# EAGLE design ESPLiveDC (EAGLE 7.7.0)
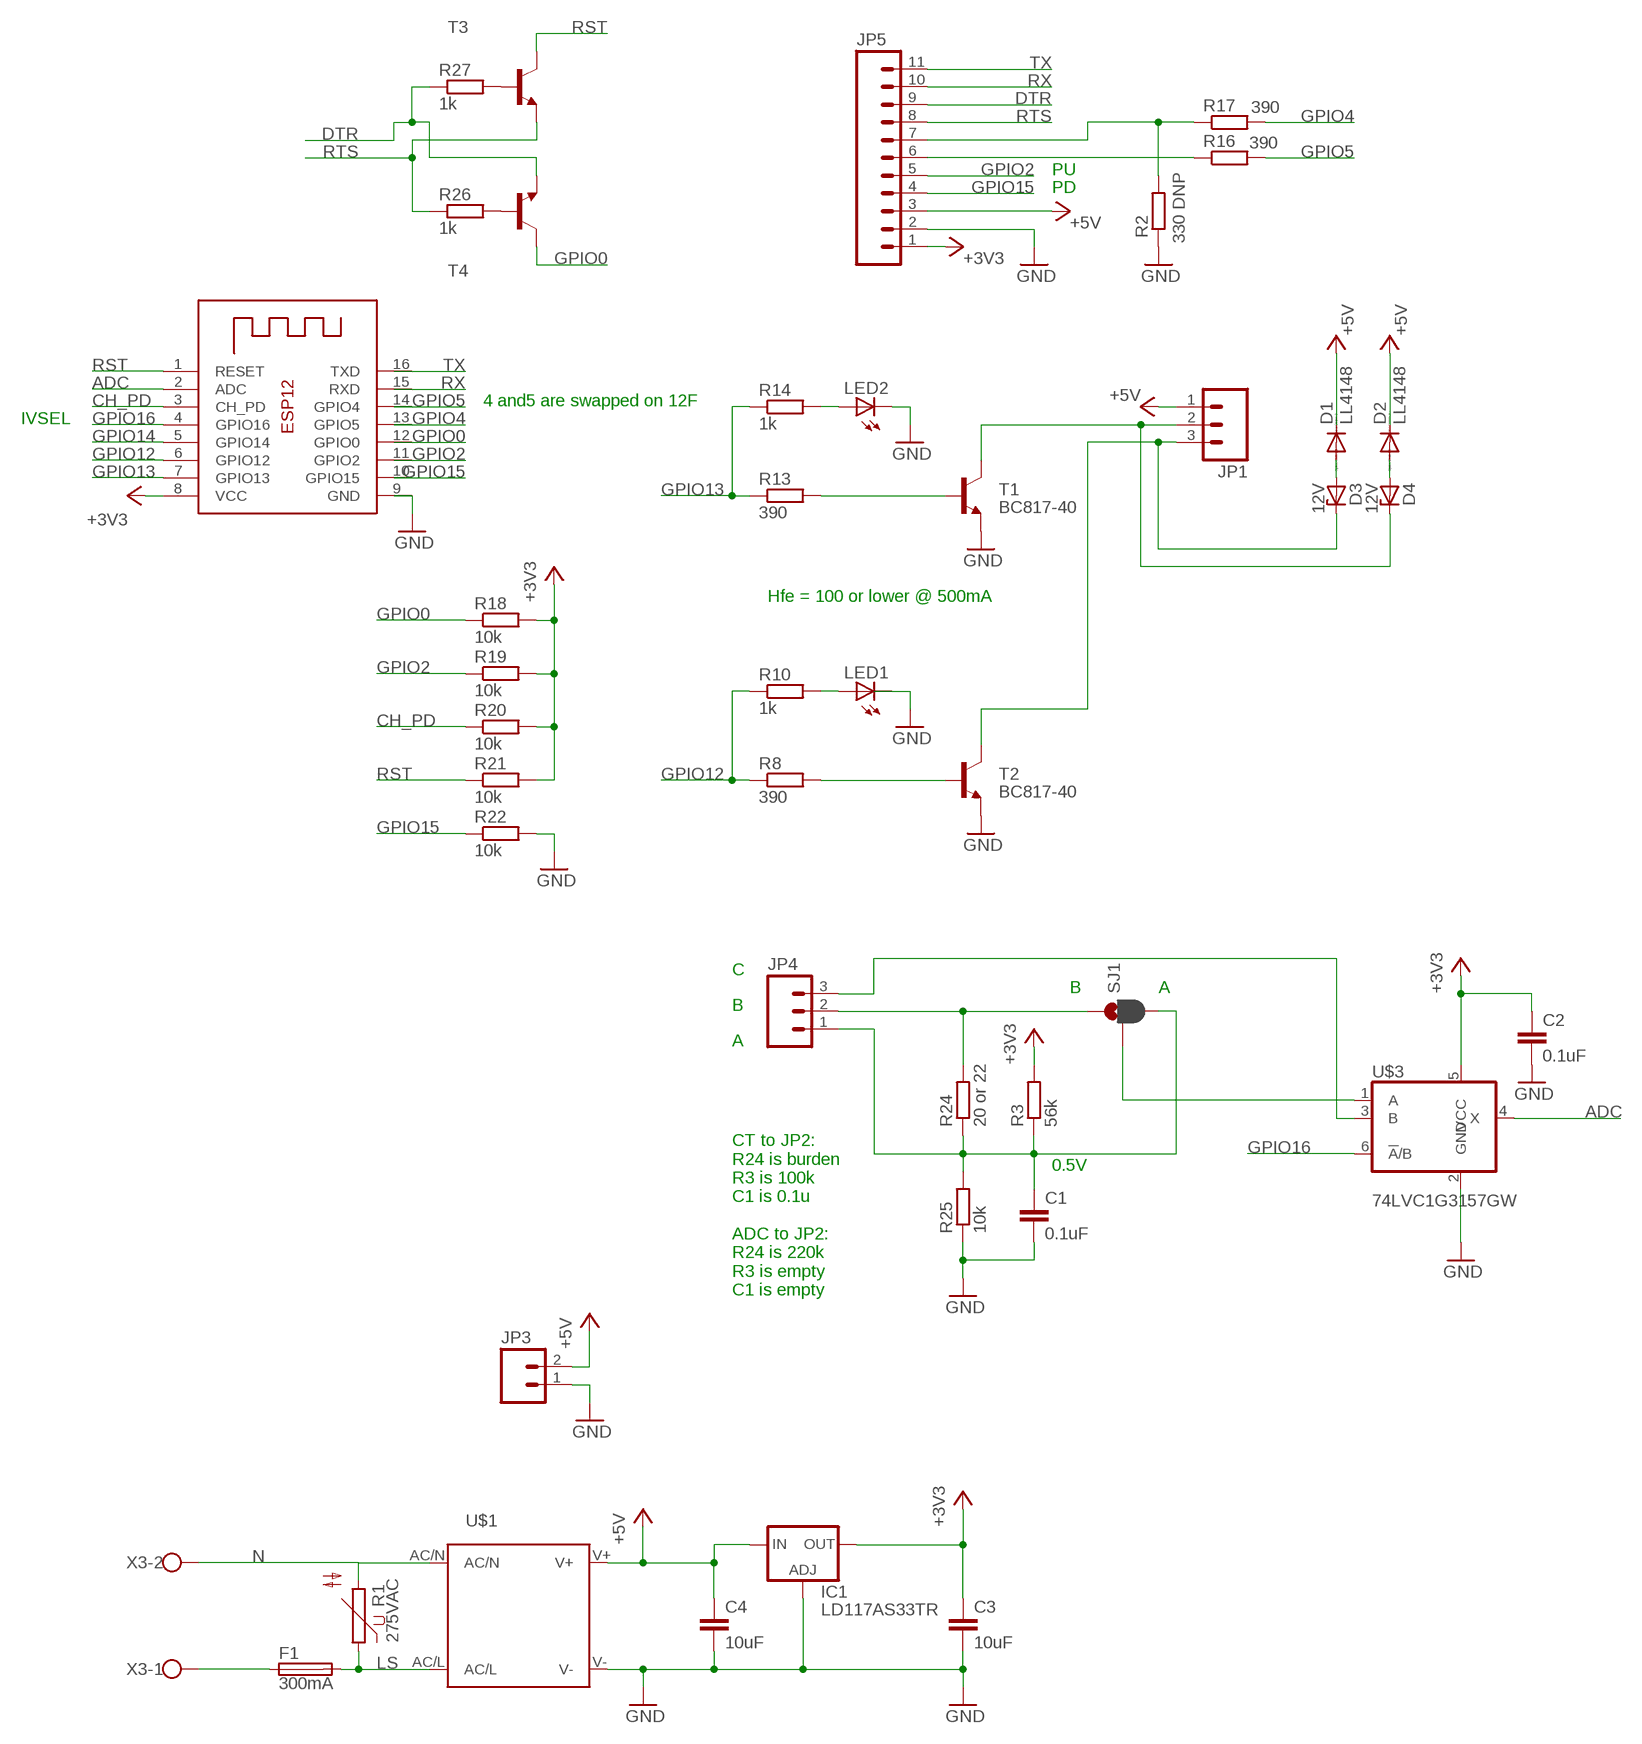
[diagram p0: schematic, sheet 1]

## Parts
C1  0.1uF  C-EUC0603  [C0603]
C2  0.1uF  C-EUC0603  [C0603]
C3  10uF  C-EUC0805  [C0805]
C4  10uF  C-EUC0805  [C0805]
D1  LL4148  DIODE-SOD80C  [SOD80C]
D2  LL4148  DIODE-SOD80C  [SOD80C]
D3  12V  ZENER-DIODESOD80C  [SOD80C]
D4  12V  ZENER-DIODESOD80C  [SOD80C]
F1  300mA  TE5  [TE5]
IC1  LD117AS33TR  [SOT223]
JP1  M03POLAR_LOCK  [MOLEX-1X3_LOCK]
JP3  M02POLAR_LOCK  [MOLEX-1X2_LOCK]
JP4  M03POLAR_LOCK  [MOLEX-1X3_LOCK]
JP5  M11LOCK  [1X11_LOCK]
LED1  LED1206  [LED-1206]
LED2  LED1206  [LED-1206]
R1  275VAC  P593  [P593]
R2  330 DNP  R-EU_R0603  [R0603]
R3  56k  R-EU_R0603  [R0603]
R8  390  R-EU_R0603  [R0603]
R10  1k  R-EU_R0603  [R0603]
R13  390  R-EU_R0603  [R0603]
R14  1k  R-EU_R0603  [R0603]
R16  390  R-EU_R0603  [R0603]
R17  390  R-EU_R0603  [R0603]
R18  10k  R-EU_R0603  [R0603]
R19  10k  R-EU_R0603  [R0603]
R20  10k  R-EU_R0603  [R0603]
R21  10k  R-EU_R0603  [R0603]
R22  10k  R-EU_R0603  [R0603]
R24  20 or 22  R-EU_R1206  [R1206]
R25  10k  R-EU_R0603  [R0603]
R26  1k  R-EU_R0603  [R0603]
R27  1k  R-EU_R0603  [R0603]
SJ1  JUMPER-PAD-3-2OF3_NC_BY_PASTE  [PAD-JUMPER-3-2OF3_NC_BY_PASTE_YES_SILK_FULL_BOX]
T1  BC817-40  BC817-40-NPN-SOT23-BEC  [SOT23-BEC]
T2  BC817-40  BC817-40-NPN-SOT23-BEC  [SOT23-BEC]
T3  BC817-40-NPN-SOT23-BEC  [SOT23-BEC]
T4  BC817-40-NPN-SOT23-BEC  [SOT23-BEC]
U$1  IRM_01/02_SMDIRM_01/02_SMD  [IRM_01/02_SMD]
U$3  74LVC1G3157GW  [SOT363]
X1  ESP-12  [ESP-12]
X3  W237-102  [W237-102]

## Nets
+3V3: C2.1 C3.1 IC1.4(OUT) JP5.1 R3.2 R18.2 R19.2 R20.2 R21.2 U$3.5(VCC) X1.8(VCC)
+5V: C4.1 D1.C D2.C IC1.3(IN) JP1.1 JP3.2 JP5.3 U$1.V+
ADC: U$3.4(X) X1.2(ADC)
CH_PD: R20.1 X1.3(CH_PD)
DTR: JP5.9 R27.1 T4.E
GND: C1.2 C2.2 C3.2 C4.2 IC1.1(ADJ) JP3.1 JP5.2 LED1.C LED2.C R2.1 R22.2 R25.1 T1.E T2.E U$1.V- U$3.2(GND) X1.9(GND)
GPIO0: R18.1 T4.C X1.12(GPIO0)
GPIO2: JP5.5 R19.1 X1.11(GPIO2)
GPIO4: R17.2 X1.13(GPIO5)
GPIO5: R16.2 X1.14(GPIO4)
GPIO12: R8.1 R10.1 X1.6(GPIO12)
GPIO13: R13.1 R14.1 X1.7(GPIO13)
GPIO14: X1.5(GPIO14)
GPIO15: JP5.4 R22.1 X1.10(GPIO15)
GPIO16: U$3.6(!A!/B) X1.4(GPIO16)
LS: F1.2 R1.1 U$1.AC/L
N: R1.2 U$1.AC/N X3.2
N$1: R13.2 T1.B
N$2: LED1.A R10.2
N$3: R8.2 T2.B
N$5: D4.C JP1.2 T1.C
N$6: D3.C JP1.3 T2.C
N$7: F1.1 X3.1
N$8: D1.A D3.A
N$9: D2.A D4.A
N$10: C1.1 JP4.1 R3.1 R24.1 R25.2 SJ1.3
N$11: JP4.2 R24.2 SJ1.1
N$12: SJ1.2 U$3.1(A)
N$13: JP4.3 U$3.3(B)
N$14: LED2.A R14.2
N$19: JP5.6 R16.1
N$20: JP5.7 R2.2 R17.1
N$22: R26.2 T4.B
N$23: R27.2 T3.B
RST: R21.1 T3.C X1.1(RESET)
RTS: JP5.8 R26.1 T3.E
RX: JP5.10 X1.15(RXD)
TX: JP5.11 X1.16(TXD)

## Notes on the sheet
- PU
- PD
- 4 and5 are swapped on 12F
- IVSEL
- Hfe = 100 or lower @ 500mA
- C
- B | A
- B
- A
- 0.5V
- CT to JP2:
  R24 is burden
  R3 is 100k
  C1 is 0.1u
  
  ADC to JP2:
  R24 is 220k
  R3 is empty
  C1 is empty

## Library data of the parts
C1-C4 = rcl:C-EU: CAPACITOR, European symbol
D1 D2 = diode:DIODE-: DIODE
D3 D4 = diode:ZENER-DIODE: Z-Diode
F1 = fuse:TE5: FUSE Wickmann; OC_FARNELL: unknown; OC_NEWARK: unknown
IC1 = v-reg:LD117A?*: Low drop fixed and adjustable positive voltage regulators 1 A Source: http://www.st.com/stonline/products/literature/ds/7194/ld1117axx.pdf
JP1 JP4 = SparkFun-Connectors:M03: Header 3 Standard 3-pin 0.1" header. Use with straight break away headers (SKU : PRT-00116), right angle break away headers (PRT-00553), swiss pins (PRT-00743), machine pins (PRT-00117), and female headers (PRT-00115). Molex polarized connector foot print use with SKU : PRT-08232 with associated crimp pins and housings.
JP3 = SparkFun-Connectors:M02: Standard 2-pin 0.1" header. Use with - straight break away headers ( PRT-00116) - right angle break away headers (PRT-00553) - swiss pins (PRT-00743) - machine pins (PRT-00117) - female headers (PRT-00115) Molex polarized connector foot print use with: PRT-08233 with associated crimp pins and housings. 2.54_SCREWTERM for use with PRT-10571. 3.5mm Screw Terminal footprints for PRT-08084 5mm Screw Terminal footprints for use with PRT-08432
JP5 = SparkFun-Connectors:M11: Header 11 Standard 11-pin 0.1" header. Use with straight break away headers (SKU : PRT-00116), right angle break away headers (PRT-00553), swiss pins (PRT-00743), machine pins (PRT-00117), and female headers (PRT-00115).
LED1 LED2 = SparkFun:LED: LEDs Standard schematic elements and footprints for 5mm, 3mm, 1206, and 0603 sized LEDs. 5mm - Spark Fun Electronics SKU : COM-00529 (and others)
R1 = varistor:P593: VARISTOR
R2 R3 R8 R10 R13 R14 R16-R22 R24-R27 = rcl:R-EU_: RESISTOR, European symbol
SJ1 = SparkFun-Passives:JUMPER-PAD-3-2OF3_NC_BY_PASTE
T1-T4 = transistor:*-NPN-: NPN Transistror BF959 corrected 2008.03.06
U$1 = meanwell_irm_v7:IRM_01/02_SMD: 1 or 2 watt housing & pin compatible IRM 01 Vout [V] Imax [A] Pmax [W] Eff [%] 3.3 0.3 1 66 5 0.2 1 70 9 0.111 1 72 12 0.083 1 74 15 0.067 1 75 24 0.042 1 77 IRM 2 Vout [V] Imax [A] Pmax [W] Eff [%] 3.3 0.6 2 66 5 0.4 2 70 9 0.222 2 72 12 0.167 2 74 15 0.133 2 75 24 0.087 2 77
U$3 = SparkFun-DigitalIC:74LVC1G3157GW
X1 = adafruit:ESP-12
X3 = con-wago-500:W237-102: WAGO SCREW CLAMP; MPN: 237-102; OC_FARNELL: unknown; OC_NEWARK: 70K9898

## Board
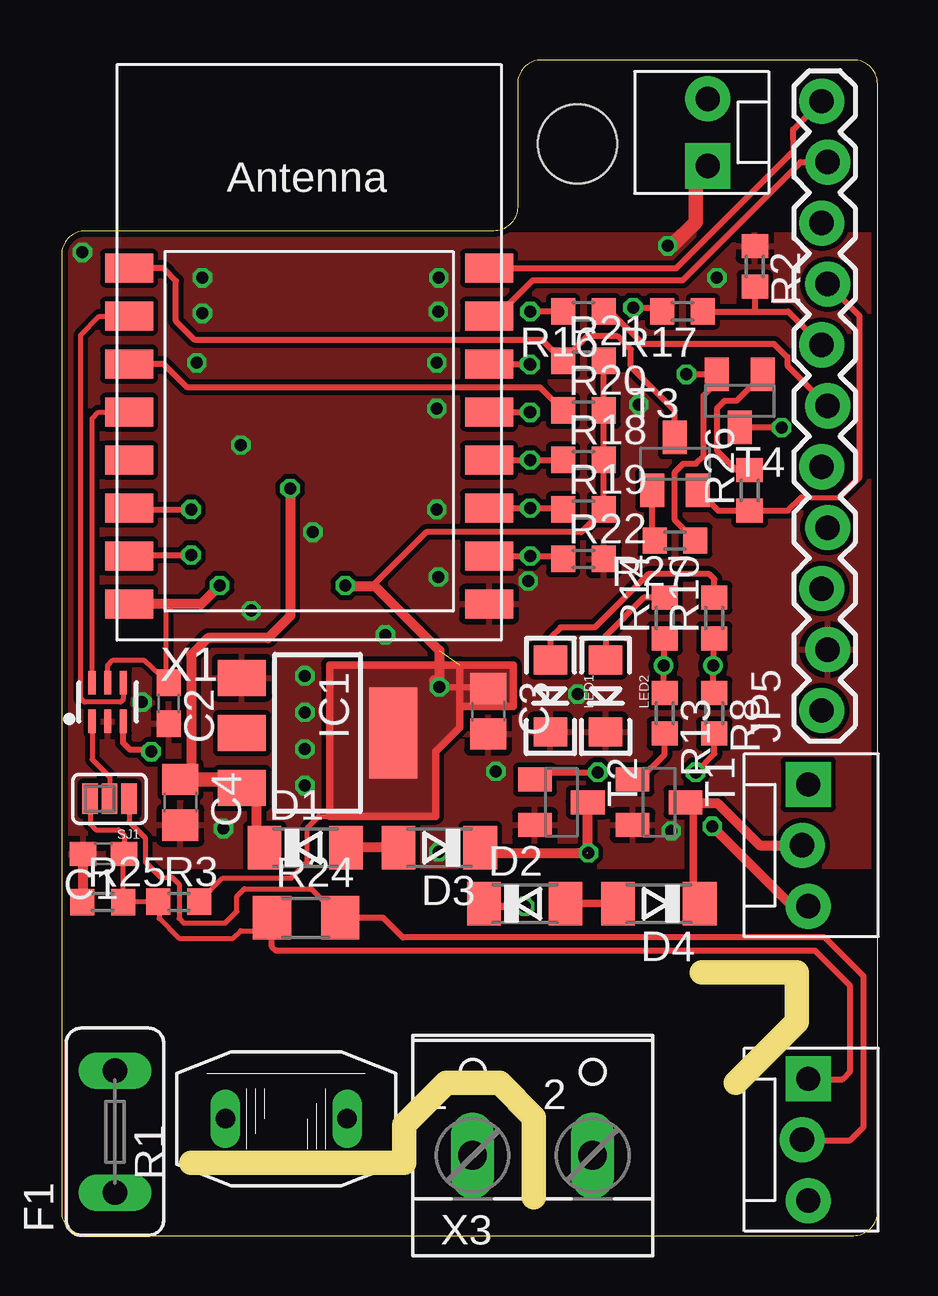
[diagram p1: board, top side]
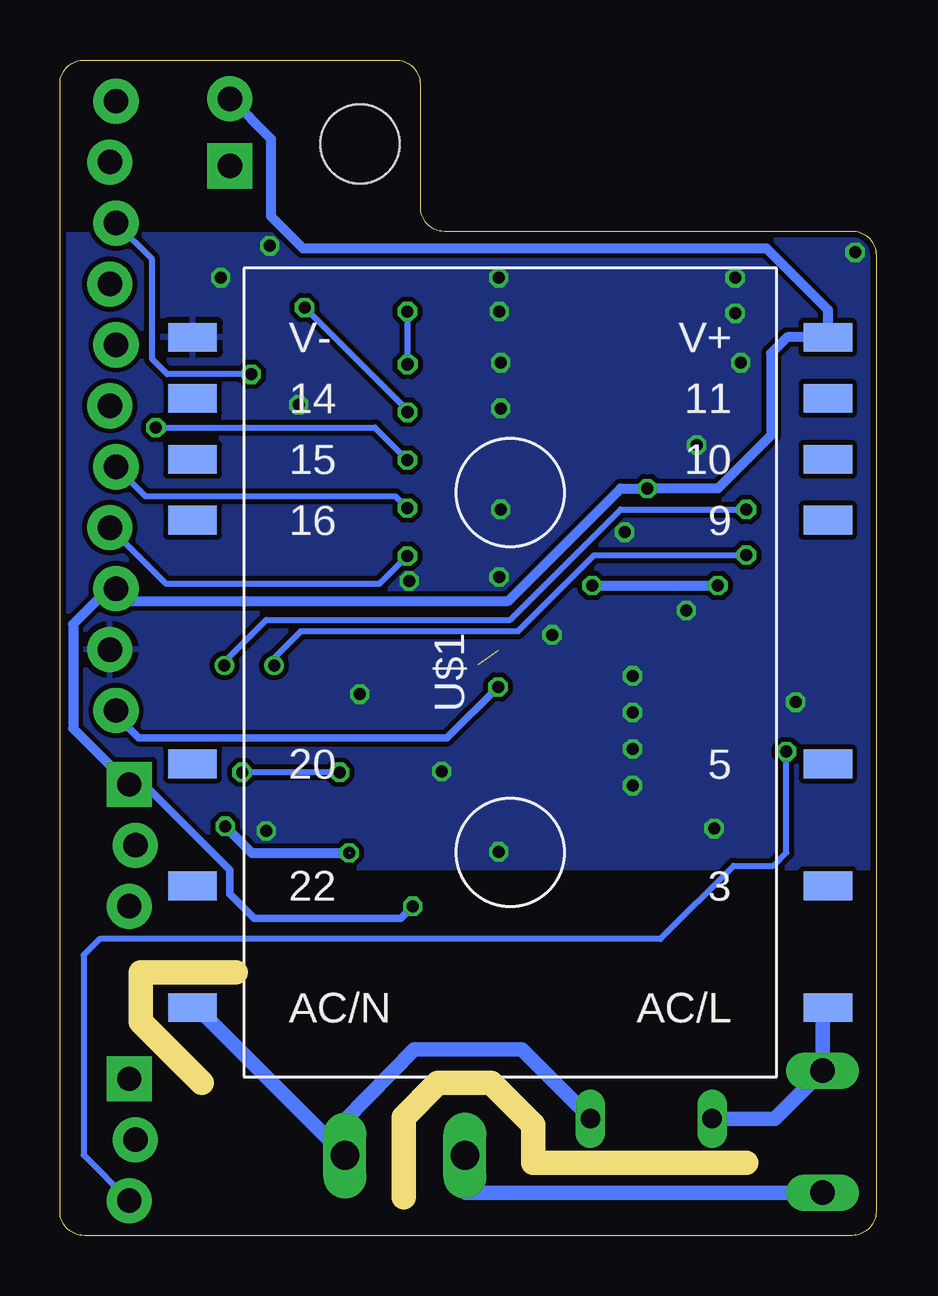
[diagram p2: board, bottom side, seen from below]

Size 34 x 49 mm. Coordinates in mm from the lower left corner, seen from the top.
Outline: 0,40.87 0,1 arc90 1,0 33,0 arc90 34,1 34,48 arc90 33,49 20,49 arc90 19,48 19,42.87 arc-90 18,41.87 1,41.87 arc90 0,40.87
Copper layers (1*16): Top 0.035mm / dielectric 1.6mm / Bottom 0.035mm
Design rules "Elecrow_2-layer_PCB_eagle_rule *": minimum track width 6mil, minimum drill 12mil, track to track 8mil, track to pad 8mil, pad to pad 8mil, via to via 8mil, smd to smd 0mil, copper to edge 10mil, drill to drill 10mil, minimum pad ring 6mil, minimum via ring 6mil, stop-mask expansion 0mil, vias tented up to drill 100mil, thermal gap 10mil
Holes 3.3 mm at 21.5,45.5
Milling: 9 lines

### Footprints (pad centres in the part's own frame; a part is rotated, then mirrored left to right if it is on the bottom)
C0603 = smd 1.1 x 1: 1 -0.85,0; 2 0.85,0
C0805 = smd 1.3 x 1.5: 1 -0.95,0; 2 0.95,0
SOD80C = smd 1.4 x 1.8: A 1.7,0; C -1.7,0
TE5 = drill 1.016 long: 1 -2.54,0; 2 2.54,0
SOT223 = smd 1.5 x 2: 1 -2.3,-3.15; 2 0,-3.15; 3 2.3,-3.15 | smd 3.8 x 2: 4 0,3.15
MOLEX-1X3_LOCK = drill 1.016 pad 1.88 square: 1 0,0.127 | drill 1.016 pad 1.88: 2 2.54,-0.127; 3 5.08,0.127
MOLEX-1X2_LOCK = drill 1.016 pad 1.88 square: 1 -0.127,0 | drill 1.016 pad 1.88: 2 2.667,0
1X11_LOCK = drill 1.016 pad 1.88: 1 0,0.127; 2 2.54,-0.127; 3 5.08,0.127; 4 7.62,-0.127; 5 10.16,0.127; 6 12.7,-0.127; 7 15.24,0.127; 8 17.78,-0.127; 9 20.32,0.127; 10 22.86,-0.127; 11 25.4,0.127
LED-1206 = smd 1.2 x 1.4: A -1.5,0; C 1.5,0
P593 = drill 0.813 long: 1 0,2.54; 2 0,-2.54
R0603 = smd 1 x 1.1: 1 -0.85,0; 2 0.85,0
R1206 = smd 1.6 x 1.803: 1 -1.422,0; 2 1.422,0
PAD-JUMPER-3-2OF3_NC_BY_PASTE_YES_SILK_FULL_BOX = smd 0.635 x 1.27: 1 -0.813,0; 2 0,0; 3 0.813,0
SOT23-BEC = smd 1 x 1.4: B -0.95,-1.1; C 0,1.1; E 0.95,-1.1
IRM_01/02_SMD = smd 1.2 x 2.03: AC/L -13.97,-13.235; AC/N -13.97,13.235; P$3 -8.89,-13.235; P$5 -3.81,-13.235; P$9 6.35,-13.235; P$10 8.89,-13.235; P$11 11.43,-13.235; P$14 11.43,13.235; P$15 8.89,13.235; P$16 6.35,13.235; P$20 -3.81,13.235; P$22 -8.89,13.235; V+ 13.97,-13.235; V- 13.97,13.235
SOT363 = smd 0.3 x 0.99: 1 -0.65,-0.8; 2 0,-0.8; 3 0.65,-0.8; 4 0.65,0.81; 5 0,0.81; 6 -0.65,0.81
ESP-12 = smd 2 x 1.2: 1 -7.5,4.5; 2 -7.5,2.5; 3 -7.5,0.5; 4 -7.5,-1.5; 5 -7.5,-3.5; 6 -7.5,-5.5; 7 -7.5,-7.5; 8 -7.5,-9.5; 9 7.5,-9.5; 10 7.5,-7.5; 11 7.5,-5.5; 12 7.5,-3.5; 13 7.5,-1.5; 14 7.5,0.5; 15 7.5,2.5; 16 7.5,4.5
W237-102 = drill 1.194 long: 1 -2.5,-1.27; 2 2.5,-1.27

### Placement (x,y rotation side)
C1  1.75,15.91 180 top
C2  4.46,22.19 270 top
C3  17.78,21.85 270 top
C4  4.95,18.06 270 top
D1  10.16,16.17 0 top
D2  19.3,13.84 0 top
D3  15.75,16.17 180 top
D4  24.89,13.84 180 top
F1  2.22,4.33 90 top
IC1  10.67,20.95 270 top
JP1  30.99,18.8 270 top
JP3  26.92,44.71 90 top
JP4  30.99,6.53 270 top
JP5  31.8,21.88 90 top
LED1  20.37,22.49 270 top
LED2  22.67,22.49 270 top
R1  9.36,4.87 90 top
R2  28.89,40.39 270 top
R3  4.89,13.91 0 top
R8  27.2,21.77 270 top
R10  27.2,25.74 90 top
R13  25.13,21.77 270 top
R14  25.13,25.74 90 top
R16  21.75,38.52 180 top
R17  25.88,38.52 180 top
R18  21.75,32.33 0 top
R19  21.75,30.27 0 top
R20  21.75,34.39 0 top
R21  21.75,36.46 0 top
R22  21.75,28.2 0 top
R24  10.19,13.25 0 top
R25  1.71,13.9 0 top
R26  28.67,31.06 90 top
R27  25.56,28.97 180 top
SJ1  2,18.2 180 top
T1  24.89,18.06 270 top
T2  20.83,18.06 270 top
T3  25.56,32.17 0 top
T4  28.26,34.79 180 top
U$1  15.24,23.47 90 bottom
U$3  1.92,22.23 0 top
X1  10.32,35.82 0 top
X3  19.63,4.61 0 top

### Tracks (layer width: path | path; a pad name or v marks a point on that pad's centre or on a via)
+3V3  (via drill 0.5)  (1 unrouted)
  Top 0.203: 4.57,26.32 4.46,26.21 arc90 4.37,26.12 4.37,23.42 C2.1 3.44,23.98 2.14,23.98 1.92,23.76 U$3.5 | R3.2 6.73,14.9 9.58,14.9 10.24,15.56 10.24,16.99 10.72,17.47 11.18,17.47
  Top 0.254: v11.83,27.09 12.97,27.09 15.19,29.31 21.65,29.31 R19.2 R18.2 R20.2 R21.2 | v15.75,22.87 17.78,22.87
  Top 0.305: 16.59,23.79 11.18,23.79 11.18,17.47 15.59,17.47 15.59,20.17 16.59,21.17 16.59,22.04 | 16.59,22.04 16.59,23.79 | 16.59,23.79 18.81,23.79 18.81,22.04 16.59,22.04
  Top 0.406: v6.59,27.09 5.82,26.32 4.57,26.32 X1.8 | v11.83,27.09 12.13,27.08 13.06,27.08 15.75,24.39 v15.75,22.87 15.51,23.14
  Bottom 0.305: JP5.1 31.67,21.69 30.72,20.74 17.88,20.74 v15.75,22.87
  Bottom 0.406: v11.83,27.09 v6.59,27.09
  pour Top (no thermals): 11.21,23.79 16.02,23.79 18.8,23.77 18.76,22.12 16.57,22.12 16.56,22.11 16.56,21.15 15.56,20.2 15.56,17.52 11.21,17.52
+5V  (via drill 0.5)
  Top 0.305: D2.C 17.6,13.72 v19.3,13.72
  Top 0.406: v9.53,31.14 9.53,25.82 8.6,24.9 6.1,24.9 5.4,24.2 5.4,19.03 4.95,18.58 C4.1 | D1.C 8.13,16.5 8.13,18.3 7.78,18.65 IC1.3
  Top 0.61: IC1.3 7.37,19.01 C4.1
  Bottom 0.305: v19.3,13.72 19.81,13.22 25.91,13.22 26.92,14.23 26.92,15.25 30.48,18.8 JP1.1
  Bottom 0.406: 31.16,26.46 15.32,26.46 10.64,31.14 v9.53,31.14 6.59,31.14 4.37,33.36 4.37,36.78 3.7,37.44 U$1.V+ 2,38.59 4.57,41.16 23.88,41.16 25.21,42.49 25.21,45.72 26.87,47.38 JP3.2 | 31.16,26.46 JP5.3 | 31.16,26.46 32.24,26.69 33.45,25.49 33.45,21.14 JP1.1
ADC
  Top 0.203: U$3.4 2.57,22.34 2.46,22.23 0.96,22.23 0.79,22.39 0.79,37.54 1.58,38.32 X1.2
CH_PD
  Top 0.254: X1.3 4.26,36.32 5.24,35.35 19.95,35.35 R20.1
DTR  (via drill 0.5)
  Top 0.254: R27.1 25.56,29.82 25.56,31.82 25.91,32.17 26.43,32.17 26.75,32.49 26.75,35.03 27.31,35.59 T4.E v26.05,35.89 v26.04,35.9
  Bottom 0.254: v26.04,35.9 29.53,35.9 30.16,36.54 30.16,40.7 JP5.9
GND  (via drill 0.5)
  Top 0.406: R25.1 arc45 0.9,13.97 C1.2
  Top 0.61: JP3.1 26.42,44.08 26.42,42.25 25.4,41.23 v25.26,41.25
  other vias: 3.35,22.23 10.14,23.33 21.51,22.57 19.45,27.28 15.7,27.45 24.05,34.63 10.48,29.31 15.64,30.27 15.64,36.38 5.64,36.38 5.87,38.44 15.72,39.92 5.87,39.92 0.87,40.98 15.7,38.52 7.48,32.95 15.64,34.47 18.1,19.34 10.14,21.8 10.14,20.28 10.14,18.76 13.49,25.04 25.4,16.86 6.75,16.96 27.3,39.92 15.72,15.99 7.91,26.06
  pour Top: 0,41.7 34.29,41.7 34.13,15.39 -0.16,15.39
  pour Bottom: 0,41.7 34.8,41.7 34.72,15.36 -0.08,15.36
GPIO0  (via drill 0.5)
  Top 0.254: X1.12 v19.53,32.32 R18.1 | T4.C 30.23,33.69 v30,33.68
  Bottom 0.254: v30,33.68 20.88,33.68 v19.53,32.32
GPIO2  (via drill 0.5)
  Top 0.254: X1.11 v19.53,30.32 20.84,30.32 R19.1
  Bottom 0.254: v19.53,30.32 20.03,30.82 30.45,30.82 JP5.5
GPIO4  (via drill 0.5)
  Top 0.254: v19.53,34.31 v19.52,34.32 X1.13 | v23.81,38.68 24.87,38.68 R17.2
  Bottom 0.254: v19.52,34.32 19.61,34.32 19.61,34.48 v23.81,38.68
GPIO5  (via drill 0.5)
  Top 0.254: v19.53,36.3 v19.5,36.32 X1.14 | R16.2 v19.53,38.52
  Bottom 0.254: v19.5,36.32 19.5,38.5 v19.53,38.52
GPIO12  (via drill 0.5)
  Top 0.254: X1.6 2.88,30.27 v5.4,30.27 | v27.15,23.76 27.2,23.7 | R10.1 27.15,24.84 v27.15,23.76 | R8.1 27.15,22.68 v27.15,23.76
  Bottom 0.254: v27.15,23.76 27.15,23.92 25.4,25.66 15.24,25.66 10.64,30.27 v5.4,30.27 5.56,30.27
GPIO13  (via drill 0.5)
  Top 0.254: X1.7 2.86,28.36 v5.4,28.36 | v25.08,23.76 25.13,23.81 | R13.1 25.08,22.68 v25.08,23.76 | R14.1 25.08,24.84 v25.08,23.76
  Bottom 0.254: v25.08,23.76 25.08,24.07 23.97,25.19 14.92,25.19 11.75,28.36 v5.4,28.36
GPIO15  (via drill 0.5)
  Top 0.254: X1.10 v19.53,28.32 20.78,28.32 R22.1
  Bottom 0.254: v19.53,28.32 20.68,27.17 29.59,27.17 JP5.4
GPIO16
  Top 0.203: U$3.6 1.27,34.06 1.53,34.32 X1.4
LS
  Bottom 0.61: U$1.AC/L 2.22,9.28 F1.2 4.23,4.87 R1.1
N
  Bottom 0.61: R1.2 11.87,4.87 14.76,7.75 19.24,7.75 22.13,4.8 X3.2 27.97,9.18 U$1.AC/N
N$1
  Top 0.254: T1.B 24.08,19.01 25.13,20.06 R13.2
N$2
  Top 0.254: R10.2 27.2,27.36 26.99,27.57 24.45,27.57 22.23,25.34 20.8,25.34 20.37,24.92 LED1.A
N$3  (via drill 0.5)
  Top 0.254: T2.B 19.52,19.31 v22.35,19.31 | v26.42,19.31 27.2,20.09 R8.2
  Bottom 0.254: v22.35,19.31 v26.42,19.31
N$5
  Top 0.305: D4.C 26.31,14.11 26.31,18.06 T1.C
  Top 0.406: T1.C 26.02,18.03 27.32,18.03 29.08,16.26 JP1.2
N$6  (via drill 0.5)  (1 unrouted)
  Top 0.356: T2.C 21.39,18.09
  Top 0.406: 17.37,16.13 D3.C 17.69,15.93 21.91,15.93 | v21.95,15.95 21.93,15.97 T2.C | v27.11,17.06 30.45,13.72 JP1.3
  Bottom 0.406: v27.11,17.06 26,15.95 v21.95,15.95
N$7
  Bottom 0.61: X3.1 17.1,1.79 F1.1
N$8
  Top 0.406: D3.A D1.A
N$9
  Top 0.305: D2.A D4.A
N$10
  Top 0.203: R25.2 2.56,15.88 | R3.1 2.58,13.91 | SJ1.3 1.19,17.16 1.43,16.91 2.38,16.91 2.62,16.68 2.62,15.94 | 4.06,13.89 4.06,13.22 4.89,12.39 7.14,12.39 7.46,12.71 8.77,12.71
  Top 0.254: 2.56,15.88 C1.1 2.62,15.94 | 2.58,13.91 R25.2 | R3.1 4.06,13.89 | 9.14,12.71 8.77,13.08 R24.1 8.77,12.71 8.77,12.03 8.94,11.87 31.4,11.87 32.86,10.41 32.86,6.83 32.54,6.52 31.13,6.52 JP4.1
N$11
  Top 0.203: SJ1.1 2.81,17.25 3.49,16.57 3.49,15.56 4.13,14.93 4.6,14.93 4.9,14.64 4.9,13.21 5.08,13.03 6.83,13.03 7.3,13.5 7.3,14.14 7.62,14.45 10.41,14.45 R24.2
  Top 0.254: JP4.2 30.88,3.98 32.86,3.98 33.42,4.53 33.42,10.8 31.8,12.42 14.22,12.42 13.4,13.25 R24.2 11.68,13.25
N$12
  Top 0.203: U$3.1 1.27,19.85 2,19.12 SJ1.2
N$13  (via drill 0.5)
  Top 0.254: U$3.3 2.57,20.54 2.86,20.25 3.73,20.25 v3.73,20.17
  Bottom 0.254: JP4.3 33.02,3.36 33.02,11.69 32.35,12.36 8.98,12.36 5.94,15.41 4.29,15.41 3.73,15.96 v3.73,20.17
N$14
  Top 0.254: R14.2 24.27,26.59 22.67,25 LED2.A
N$19
  Top 0.254: R16.1 22.86,38.52 24.21,37.17 29.69,37.17 30.24,36.62 30.24,36.26 JP5.6
N$20
  Top 0.254: R17.1 28.96,38.52 | 28.96,38.52 30.27,38.52 JP5.7 | R2.2 28.89,38.58 28.96,38.52
N$22
  Top 0.254: T4.B 28.11,34.79 27.62,34.79 27.3,34.47 27.3,32.73 28.12,31.91 R26.2
N$23
  Top 0.254: R27.2 24.61,29.07 T3.B
RST
  Top 0.254: X1.1 4.23,40.32 4.76,39.79 4.76,38.12 5.56,37.33 20.03,37.33 R21.1 20.9,36.48 21.91,37.49 23.17,37.49 23.73,36.93 23.73,36.23 25.56,34.39 T3.C
RTS
  Top 0.203: 30.83,30.77 32.41,30.77
  Top 0.254: T3.E 27.37,30.21 R26.1 30.27,30.21 30.83,30.77 | 32.41,30.77 33.26,31.61 33.26,38.33 JP5.8
RX
  Top 0.254: 17.86,38.36 X1.15 18.18,38.68 18.49,38.68 19.64,39.82 25.88,39.82 30.8,44.74 JP5.10
TX
  Top 0.254: X1.16 25.61,40.32 30.5,45.22 30.48,46.1 JP5.11

### Text on the board
bStop: MCM
Holes: 6.8 | 17.8
tDocu: TX | RX | DTR | ESP-12F/S | RTS | 5 | 4 | 2 | 15 | 5V | 12 | 13 | GND | 3V3 | 5V | A | B | 13 | 12 | MCM | ESPLive2 | L | N | A | B | C
bDocu: 5V | GND | 46x21.5 | RTS | DTR | RX | TX
Notes: 49mm | 19.6mm thickness (1.6mm PCB) | 34mm